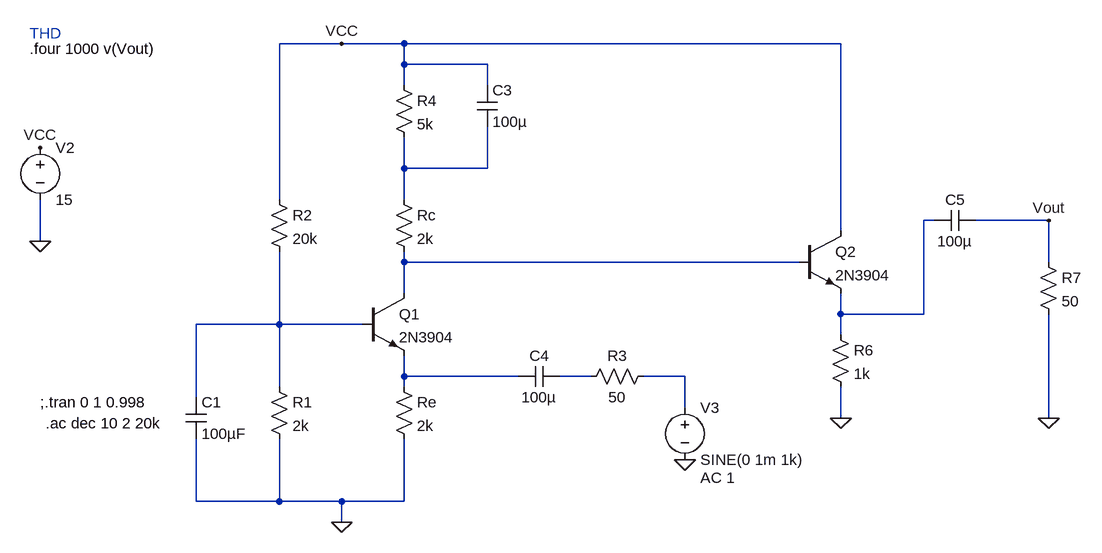
[diagram p0: schematic cb_bjt_amplifier.asc]
cb_bjt_amplifier.asc, the LTspice schematic file:
Version 4
SHEET 1 1268 700
WIRE 112 -272 16 -272
WIRE 208 -272 112 -272
WIRE 880 -272 208 -272
WIRE 208 -240 208 -272
WIRE 336 -240 208 -240
WIRE 208 -208 208 -240
WIRE 336 -208 336 -240
WIRE 208 -80 208 -128
WIRE 336 -80 336 -144
WIRE 336 -80 208 -80
WIRE 16 -32 16 -272
WIRE 208 -32 208 -80
WIRE 1024 0 1008 0
WIRE 1200 0 1088 0
WIRE 880 16 880 -272
WIRE -352 32 -352 -32
WIRE 208 64 208 48
WIRE 816 64 208 64
WIRE 1200 64 1200 0
WIRE 208 112 208 64
WIRE 880 144 880 112
WIRE 1008 144 1008 0
WIRE 1008 144 880 144
WIRE 16 160 16 48
WIRE 16 160 -112 160
WIRE 144 160 16 160
WIRE 880 176 880 144
WIRE 208 240 208 208
WIRE 384 240 208 240
WIRE 496 240 448 240
WIRE 640 240 576 240
WIRE 16 256 16 160
WIRE 208 256 208 240
WIRE -112 272 -112 160
WIRE 640 288 640 240
WIRE 880 304 880 256
WIRE 1200 304 1200 144
WIRE -112 432 -112 336
WIRE 16 432 16 336
WIRE 16 432 -112 432
WIRE 112 432 16 432
WIRE 208 432 208 336
WIRE 208 432 112 432
WIRE 112 464 112 432
FLAG -352 32 0
FLAG -352 -112 VCC
FLAG 112 -272 VCC
FLAG 640 368 0
FLAG 112 464 0
FLAG 880 304 0
FLAG 1200 304 0
FLAG 1200 0 Vout
DATAFLAG 16 160 "round($*1000)/1000"
DATAFLAG 240 240 ""
DATAFLAG 960 144 ""
DATAFLAG 496 64 ""
DATAFLAG 288 448 "I(Re)"
SYMBOL npn 144 112 R0
SYMATTR InstName Q1
SYMATTR Value 2N3904
SYMBOL res 0 -48 R0
SYMATTR InstName R2
SYMATTR Value 20k
SYMBOL res 0 240 R0
SYMATTR InstName R1
SYMATTR Value 2k
SYMBOL res 192 -48 R0
SYMATTR InstName Rc
SYMATTR Value 2k
SYMBOL res 192 240 R0
SYMATTR InstName Re
SYMATTR Value 2k
SYMBOL voltage -352 -128 R0
WINDOW 123 24 44 Left 2
WINDOW 39 0 0 Left 0
SYMATTR InstName V2
SYMATTR Value 15
SYMBOL res 192 -224 R0
SYMATTR InstName R4
SYMATTR Value 5k
SYMBOL cap 320 -208 R0
SYMATTR InstName C3
SYMATTR Value 100µ
SYMBOL cap 448 224 R90
WINDOW 0 0 32 VBottom 2
WINDOW 3 32 32 VTop 2
SYMATTR InstName C4
SYMATTR Value 100µ
SYMBOL voltage 640 272 R0
WINDOW 123 24 124 Left 2
WINDOW 39 0 0 Left 0
SYMATTR Value2 AC 1
SYMATTR InstName V3
SYMATTR Value SINE(0 1m 1k)
SYMBOL res 592 224 R90
WINDOW 0 0 56 VBottom 2
WINDOW 3 32 56 VTop 2
SYMATTR InstName R3
SYMATTR Value 50
SYMBOL cap -128 272 R0
SYMATTR InstName C1
SYMATTR Value 100µF
SYMBOL npn 816 16 R0
SYMATTR InstName Q2
SYMATTR Value 2N3904
SYMBOL res 864 160 R0
SYMATTR InstName R6
SYMATTR Value 1k
SYMBOL res 1184 48 R0
SYMATTR InstName R7
SYMATTR Value 50
SYMBOL cap 1088 -16 R90
WINDOW 0 0 32 VBottom 2
WINDOW 3 32 32 VTop 2
SYMATTR InstName C5
SYMATTR Value 100µ
TEXT -352 280 Left 2 !;.tran 0 1 0.998
TEXT -368 -264 Left 2 !.four 1000 v(Vout)
TEXT -368 -288 Left 2 ;THD
TEXT -344 312 Left 2 !.ac dec 10 2 20k

The netlist it stands for:
* cb_bjt_amplifier.asc
Q1 N003 N004 N005 0 2N3904
R2 VCC N004 20k
R1 N004 0 2k
Rc N001 N003 2k
Re N005 0 2k
V2 VCC 0 15
R4 VCC N001 5k
C3 VCC N001 100µ
C4 N006 N005 100µ
V3 N007 0 SINE(0 1m 1k) AC 1
R3 N007 N006 50
C1 N004 0 100µF
Q2 VCC N003 N002 0 2N3904
R6 N002 0 1k
R7 Vout 0 50
C5 Vout N002 100µ
.model NPN NPN
.model PNP PNP
.lib standard.bjt
;.tran 0 1 0.998
.four 1000 v(Vout)
* THD
.ac dec 10 2 20k
.backanno
.end